# Altium schematic sheet Sheet2.SchDoc
size A4; DocumentNumber: 1; SheetNumber: 1; SheetTotal: 2
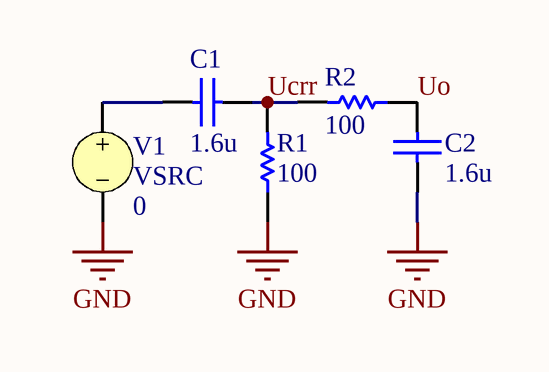
[diagram p0: Sheet2.SchDoc]

## Parts
C1  value 1.6u  (hidden comment: Capacitor)
C2  value 1.6u  (hidden comment: Capacitor)
R1  value 100  (hidden comment: Resistor)
R2  value 100  (hidden comment: Resistor)
V1  VSRC  DC Magnitude: 0

## Nets
GND: C2.1 R1.1 V1.2
Ucrr: C1.2 R1.2 R2.2
Uo: C2.2 R2.1
NetC1_1: C1.1 V1.1

## Library data of the parts
C1 C2 = Capacitor: SimulationGenericComponent: True
R1 R2 = Resistor: TC1: 0; SimulationGenericComponent: True; TC2: 0
V1 = VSRC: Voltage Source; Note: PCB Footprint - Not required; AC Magnitude: 1; Frequency: 1K; Published: 30-July-2020; LatestRevisionDate: 30-July-2020; LatestRevisionNote: Re-released for DXP Platform.; PackageReference: Not Applicable; Publisher: Altium Limited; AC Phase: 0; Offset: 0; Amplitude: 1; Delay: 0; Damping Factor: 0; Phase: 0